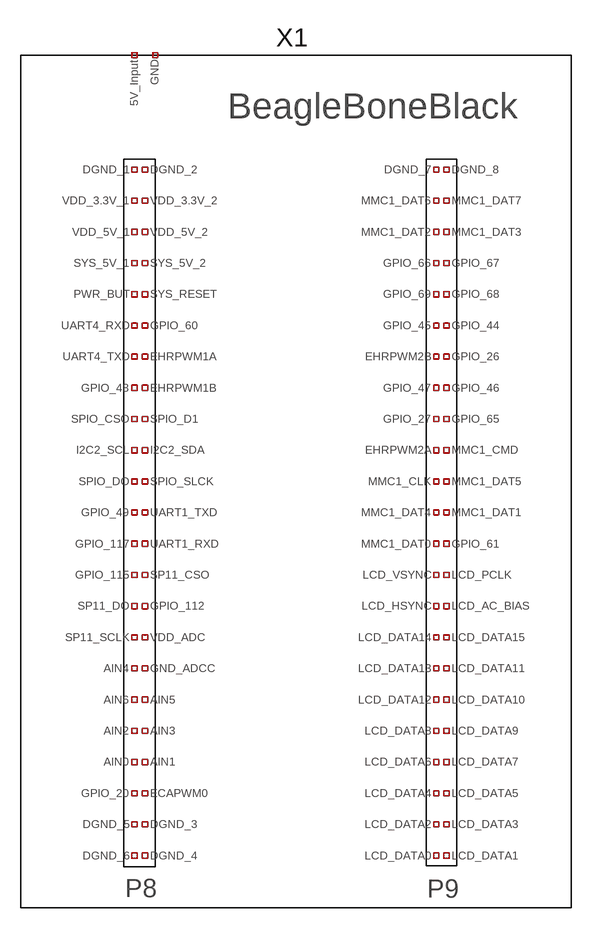
[diagram p0: schematic Beaglebone_Testbench.asc]
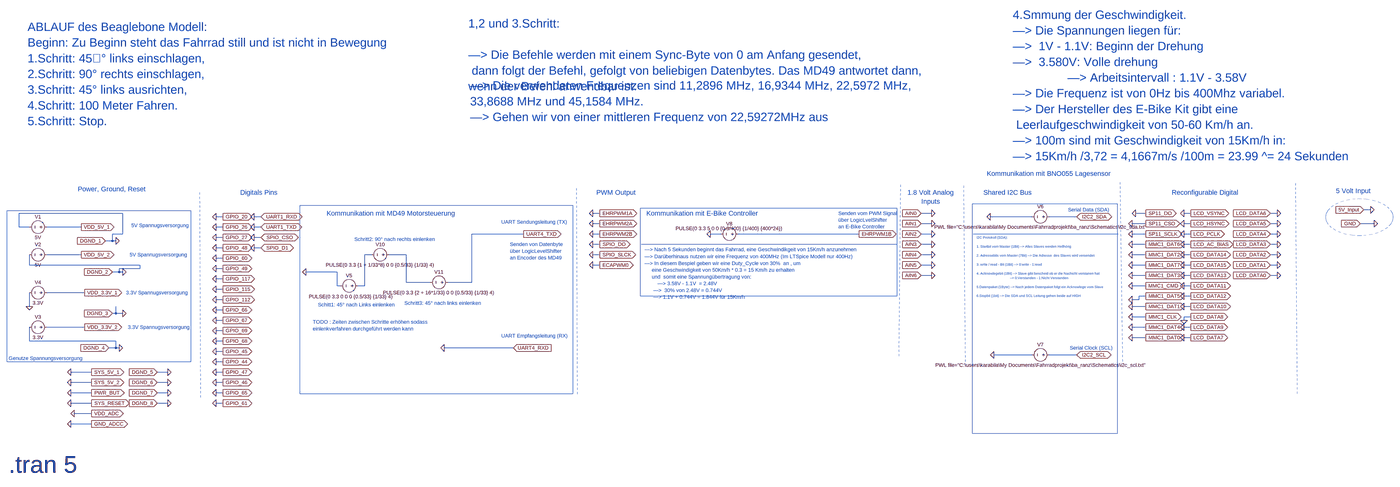
[diagram p1: sub-circuit beaglebone.asc, whole sheet]
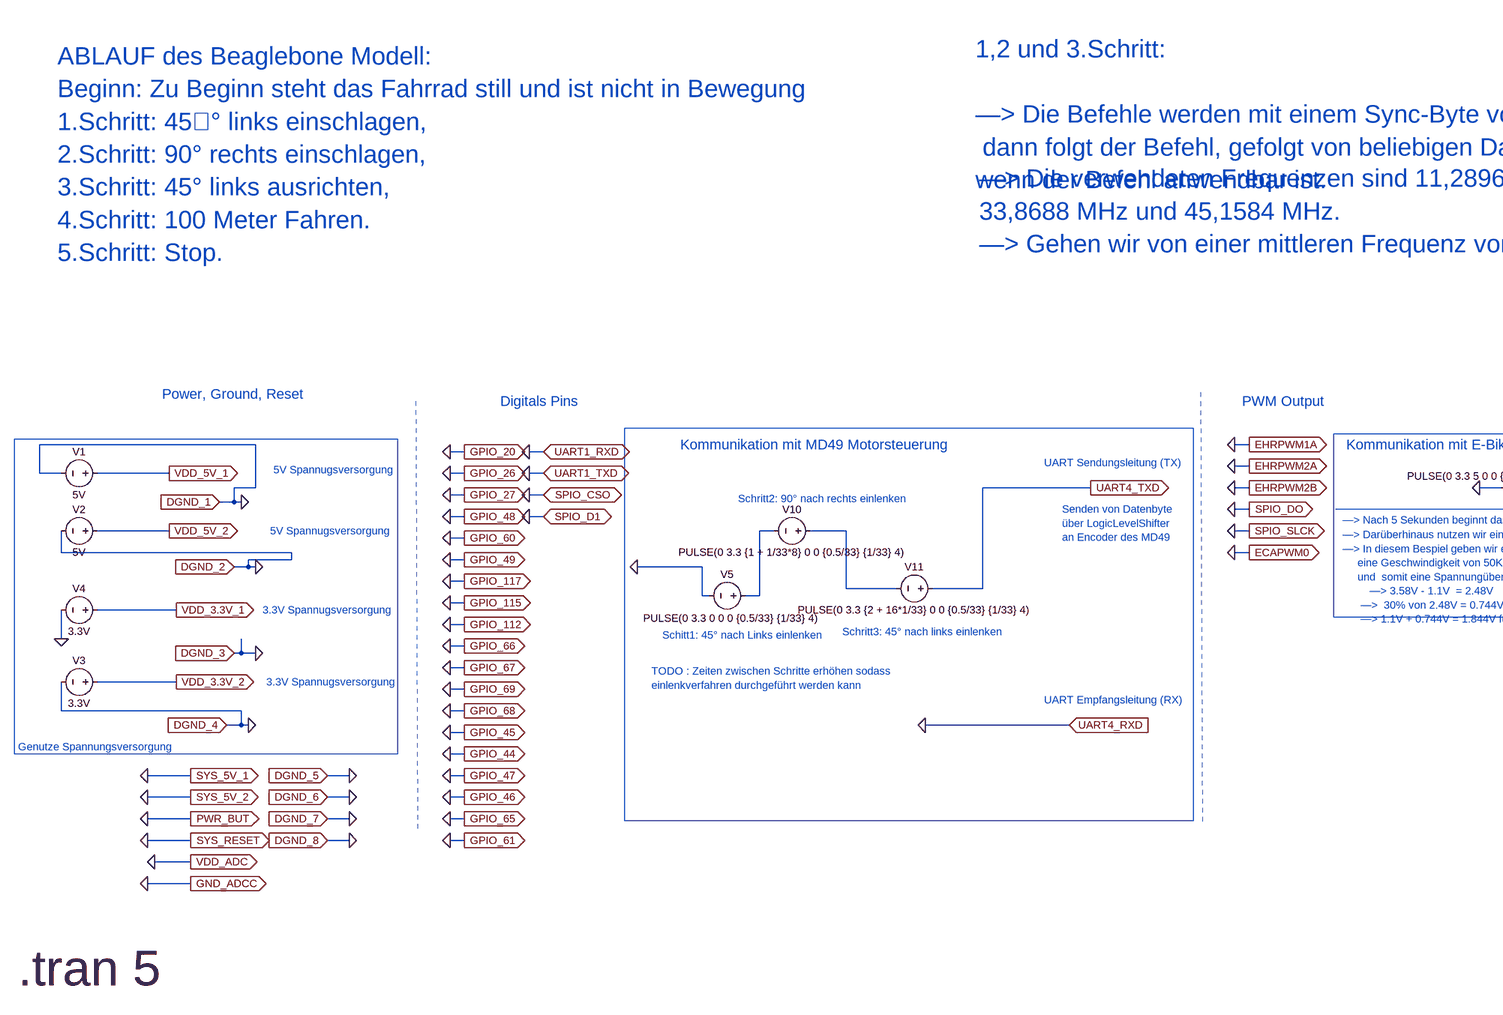
[diagram p2: sub-circuit beaglebone.asc, part, row 1 of 1, column 1 of 2]
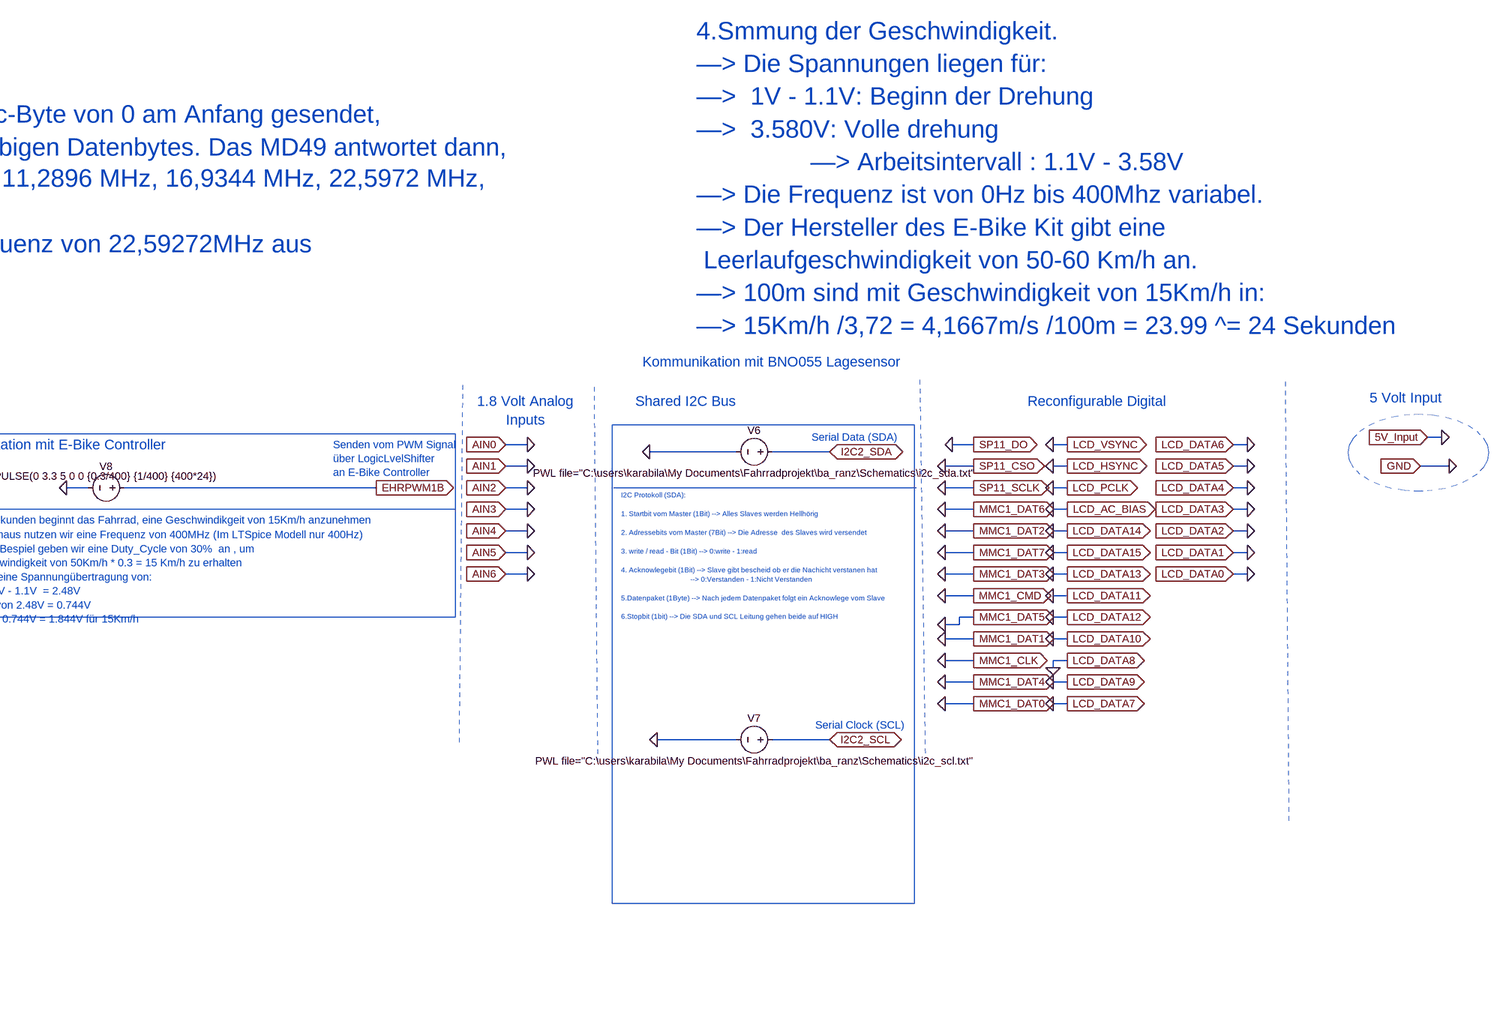
[diagram p3: sub-circuit beaglebone.asc, part, row 1 of 1, column 2 of 2]
Beaglebone_Testbench.asc, the LTspice schematic file:
Version 4
SHEET 1 880 852
SYMBOL Beaglebone 480 64 R0
SYMATTR InstName X1

beaglebone.asc, the sub-circuit schematic file:
Version 4
SHEET 1 9300 680
WIRE 7024 -2544 6992 -2544
WIRE 1248 -2528 768 -2528
WIRE 3456 -2528 3424 -2528
WIRE 4992 -2528 4944 -2528
WIRE 5984 -2528 5936 -2528
WIRE 6192 -2528 6160 -2528
WIRE 6592 -2528 6560 -2528
WIRE 1712 -2512 1680 -2512
WIRE 1888 -2512 1856 -2512
WIRE 5456 -2512 5264 -2512
WIRE 5664 -2512 5536 -2512
WIRE 3456 -2480 3424 -2480
WIRE 4992 -2480 4944 -2480
WIRE 5984 -2480 5920 -2480
WIRE 6192 -2480 6160 -2480
WIRE 6592 -2480 6560 -2480
WIRE 7040 -2480 6976 -2480
WIRE 768 -2464 768 -2528
WIRE 816 -2464 768 -2464
WIRE 1056 -2464 896 -2464
WIRE 1712 -2464 1680 -2464
WIRE 1888 -2464 1856 -2464
WIRE 1248 -2432 1248 -2528
WIRE 1248 -2432 1200 -2432
WIRE 3104 -2432 2864 -2432
WIRE 3456 -2432 3424 -2432
WIRE 4016 -2432 3968 -2432
WIRE 4656 -2432 4096 -2432
WIRE 4992 -2432 4944 -2432
WIRE 5984 -2432 5920 -2432
WIRE 6192 -2432 6160 -2432
WIRE 6592 -2432 6560 -2432
WIRE 1712 -2416 1680 -2416
WIRE 1888 -2416 1856 -2416
WIRE 1200 -2400 1200 -2432
WIRE 1200 -2400 1168 -2400
WIRE 1216 -2400 1200 -2400
WIRE 3456 -2384 3424 -2384
WIRE 4992 -2384 4944 -2384
WIRE 5984 -2384 5920 -2384
WIRE 6192 -2384 6160 -2384
WIRE 6592 -2384 6560 -2384
WIRE 1712 -2368 1680 -2368
WIRE 1888 -2368 1856 -2368
WIRE 1056 -2336 896 -2336
WIRE 2400 -2336 2368 -2336
WIRE 2560 -2336 2480 -2336
WIRE 3456 -2336 3424 -2336
WIRE 4992 -2336 4944 -2336
WIRE 5984 -2336 5920 -2336
WIRE 6192 -2336 6160 -2336
WIRE 6592 -2336 6560 -2336
WIRE 1712 -2320 1680 -2320
WIRE 816 -2288 816 -2336
WIRE 1328 -2288 816 -2288
WIRE 3456 -2288 3424 -2288
WIRE 4992 -2288 4944 -2288
WIRE 5984 -2288 5920 -2288
WIRE 6192 -2288 6160 -2288
WIRE 6592 -2288 6560 -2288
WIRE 1328 -2272 1328 -2288
WIRE 1328 -2272 1232 -2272
WIRE 1712 -2272 1680 -2272
WIRE 1232 -2256 1232 -2272
WIRE 1232 -2256 1200 -2256
WIRE 1248 -2256 1232 -2256
WIRE 2240 -2256 2096 -2256
WIRE 4992 -2240 4944 -2240
WIRE 5984 -2240 5920 -2240
WIRE 6192 -2240 6160 -2240
WIRE 6592 -2240 6560 -2240
WIRE 1712 -2224 1680 -2224
WIRE 2560 -2208 2560 -2336
WIRE 2672 -2208 2560 -2208
WIRE 2864 -2208 2864 -2432
WIRE 2864 -2208 2752 -2208
WIRE 2240 -2192 2240 -2256
WIRE 2256 -2192 2240 -2192
WIRE 2368 -2192 2368 -2336
WIRE 2368 -2192 2336 -2192
WIRE 5984 -2192 5920 -2192
WIRE 6192 -2192 6160 -2192
WIRE 1712 -2176 1680 -2176
WIRE 1072 -2160 896 -2160
WIRE 5984 -2144 5952 -2144
WIRE 6192 -2144 6160 -2144
WIRE 1712 -2128 1680 -2128
WIRE 5952 -2128 5952 -2144
WIRE 5952 -2128 5920 -2128
WIRE 816 -2096 816 -2160
WIRE 5984 -2096 5920 -2096
WIRE 6192 -2096 6160 -2096
WIRE 1712 -2080 1680 -2080
WIRE 1216 -2064 1216 -2096
WIRE 1216 -2064 1200 -2064
WIRE 1248 -2064 1216 -2064
WIRE 5984 -2048 5920 -2048
WIRE 6192 -2048 6160 -2048
WIRE 1712 -2032 1680 -2032
WIRE 6160 -2032 6160 -2048
WIRE 1072 -2000 896 -2000
WIRE 5984 -2000 5920 -2000
WIRE 6192 -2000 6160 -2000
WIRE 1712 -1984 1680 -1984
WIRE 5984 -1952 5920 -1952
WIRE 6192 -1952 6160 -1952
WIRE 816 -1936 816 -2000
WIRE 1216 -1936 816 -1936
WIRE 1712 -1936 1680 -1936
WIRE 1216 -1904 1216 -1936
WIRE 1216 -1904 1184 -1904
WIRE 1232 -1904 1216 -1904
WIRE 3056 -1904 2736 -1904
WIRE 1712 -1888 1680 -1888
WIRE 5456 -1872 5280 -1872
WIRE 5664 -1872 5536 -1872
WIRE 1712 -1840 1680 -1840
WIRE 1104 -1792 1008 -1792
WIRE 1456 -1792 1408 -1792
WIRE 1712 -1792 1680 -1792
WIRE 1104 -1744 1008 -1744
WIRE 1456 -1744 1408 -1744
WIRE 1712 -1744 1680 -1744
WIRE 1104 -1696 1008 -1696
WIRE 1456 -1696 1408 -1696
WIRE 1712 -1696 1680 -1696
WIRE 1104 -1648 1008 -1648
WIRE 1456 -1648 1408 -1648
WIRE 1712 -1648 1680 -1648
WIRE 1104 -1600 1024 -1600
WIRE 1104 -1552 1008 -1552
FLAG 1072 -2000 VDD_3.3V_2
IOPIN 1072 -2000 Out
FLAG 1072 -2160 VDD_3.3V_1
IOPIN 1072 -2160 Out
FLAG 1056 -2336 VDD_5V_2
IOPIN 1056 -2336 Out
FLAG 1056 -2464 VDD_5V_1
IOPIN 1056 -2464 Out
FLAG 1104 -1792 SYS_5V_1
IOPIN 1104 -1792 Out
FLAG 1104 -1744 SYS_5V_2
IOPIN 1104 -1744 Out
FLAG 1104 -1696 PWR_BUT
IOPIN 1104 -1696 Out
FLAG 1104 -1648 SYS_RESET
IOPIN 1104 -1648 Out
FLAG 1104 -1600 VDD_ADC
IOPIN 1104 -1600 Out
FLAG 1104 -1552 GND_ADCC
IOPIN 1104 -1552 Out
FLAG 1712 -2512 GPIO_20
IOPIN 1712 -2512 Out
FLAG 1712 -2464 GPIO_26
IOPIN 1712 -2464 Out
FLAG 1712 -2416 GPIO_27
IOPIN 1712 -2416 Out
FLAG 1712 -2368 GPIO_48
IOPIN 1712 -2368 Out
FLAG 1712 -2320 GPIO_60
IOPIN 1712 -2320 Out
FLAG 1712 -2272 GPIO_49
IOPIN 1712 -2272 Out
FLAG 1712 -2224 GPIO_117
IOPIN 1712 -2224 Out
FLAG 1712 -2176 GPIO_115
IOPIN 1712 -2176 Out
FLAG 1712 -2128 GPIO_112
IOPIN 1712 -2128 Out
FLAG 1712 -2080 GPIO_66
IOPIN 1712 -2080 Out
FLAG 1712 -2032 GPIO_67
IOPIN 1712 -2032 Out
FLAG 1712 -1984 GPIO_69
IOPIN 1712 -1984 Out
FLAG 1712 -1936 GPIO_68
IOPIN 1712 -1936 Out
FLAG 1712 -1888 GPIO_45
IOPIN 1712 -1888 Out
FLAG 1712 -1840 GPIO_44
IOPIN 1712 -1840 Out
FLAG 1712 -1792 GPIO_47
IOPIN 1712 -1792 Out
FLAG 1712 -1744 GPIO_46
IOPIN 1712 -1744 Out
FLAG 1712 -1696 GPIO_65
IOPIN 1712 -1696 Out
FLAG 1712 -1648 GPIO_61
IOPIN 1712 -1648 Out
FLAG 3056 -1904 UART4_RXD
IOPIN 3056 -1904 In
FLAG 3104 -2432 UART4_TXD
IOPIN 3104 -2432 Out
FLAG 1888 -2512 UART1_RXD
IOPIN 1888 -2512 BiDir
FLAG 1888 -2464 UART1_TXD
IOPIN 1888 -2464 BiDir
FLAG 1888 -2416 SPIO_CSO
IOPIN 1888 -2416 BiDir
FLAG 1888 -2368 SPIO_D1
IOPIN 1888 -2368 BiDir
FLAG 3456 -2528 EHRPWM1A
IOPIN 3456 -2528 Out
FLAG 4656 -2432 EHRPWM1B
IOPIN 4656 -2432 Out
FLAG 3456 -2480 EHRPWM2A
IOPIN 3456 -2480 Out
FLAG 3456 -2432 EHRPWM2B
IOPIN 3456 -2432 Out
FLAG 3456 -2384 SPIO_DO
IOPIN 3456 -2384 Out
FLAG 3456 -2336 SPIO_SLCK
IOPIN 3456 -2336 Out
FLAG 3456 -2288 ECAPWM0
IOPIN 3456 -2288 Out
FLAG 4944 -2528 AIN0
IOPIN 4944 -2528 In
FLAG 4944 -2480 AIN1
IOPIN 4944 -2480 In
FLAG 4944 -2432 AIN2
IOPIN 4944 -2432 In
FLAG 4944 -2384 AIN3
IOPIN 4944 -2384 In
FLAG 4944 -2336 AIN4
IOPIN 4944 -2336 In
FLAG 4944 -2288 AIN5
IOPIN 4944 -2288 In
FLAG 4944 -2240 AIN6
IOPIN 4944 -2240 In
FLAG 5664 -1872 I2C2_SCL
IOPIN 5664 -1872 BiDir
FLAG 5664 -2512 I2C2_SDA
IOPIN 5664 -2512 BiDir
FLAG 5984 -2528 SP11_DO
IOPIN 5984 -2528 Out
FLAG 5984 -2480 SP11_CSO
IOPIN 5984 -2480 Out
FLAG 5984 -2432 SP11_SCLK
IOPIN 5984 -2432 Out
FLAG 5984 -2384 MMC1_DAT6
IOPIN 5984 -2384 Out
FLAG 5984 -2336 MMC1_DAT2
IOPIN 5984 -2336 Out
FLAG 5984 -2288 MMC1_DAT7
IOPIN 5984 -2288 Out
FLAG 5984 -2240 MMC1_DAT3
IOPIN 5984 -2240 Out
FLAG 5984 -2192 MMC1_CMD
IOPIN 5984 -2192 Out
FLAG 5984 -2144 MMC1_DAT5
IOPIN 5984 -2144 Out
FLAG 5984 -2096 MMC1_DAT1
IOPIN 5984 -2096 Out
FLAG 5984 -2048 MMC1_CLK
IOPIN 5984 -2048 Out
FLAG 5984 -2000 MMC1_DAT4
IOPIN 5984 -2000 Out
FLAG 5984 -1952 MMC1_DAT0
IOPIN 5984 -1952 Out
FLAG 6192 -2528 LCD_VSYNC
IOPIN 6192 -2528 Out
FLAG 6192 -2480 LCD_HSYNC
IOPIN 6192 -2480 Out
FLAG 6192 -2432 LCD_PCLK
IOPIN 6192 -2432 Out
FLAG 6192 -2384 LCD_AC_BIAS
IOPIN 6192 -2384 Out
FLAG 6192 -2336 LCD_DATA14
IOPIN 6192 -2336 Out
FLAG 6192 -2288 LCD_DATA15
IOPIN 6192 -2288 Out
FLAG 6192 -2240 LCD_DATA13
IOPIN 6192 -2240 Out
FLAG 6192 -2192 LCD_DATA11
IOPIN 6192 -2192 Out
FLAG 6192 -2144 LCD_DATA12
IOPIN 6192 -2144 Out
FLAG 6192 -2096 LCD_DATA10
IOPIN 6192 -2096 Out
FLAG 6192 -2048 LCD_DATA8
IOPIN 6192 -2048 Out
FLAG 6192 -2000 LCD_DATA9
IOPIN 6192 -2000 Out
FLAG 6192 -1952 LCD_DATA7
IOPIN 6192 -1952 Out
FLAG 6560 -2528 LCD_DATA6
IOPIN 6560 -2528 In
FLAG 6560 -2480 LCD_DATA5
IOPIN 6560 -2480 In
FLAG 6560 -2432 LCD_DATA4
IOPIN 6560 -2432 In
FLAG 6560 -2384 LCD_DATA3
IOPIN 6560 -2384 In
FLAG 6560 -2336 LCD_DATA2
IOPIN 6560 -2336 In
FLAG 6560 -2288 LCD_DATA1
IOPIN 6560 -2288 In
FLAG 6560 -2240 LCD_DATA0
IOPIN 6560 -2240 In
FLAG 6992 -2544 5V_Input
IOPIN 6992 -2544 In
FLAG 1008 -1792 0
FLAG 1008 -1744 0
FLAG 1008 -1696 0
FLAG 1008 -1648 0
FLAG 1024 -1600 0
FLAG 1008 -1552 0
FLAG 1680 -2512 0
FLAG 1680 -2464 0
FLAG 1680 -2416 0
FLAG 1680 -2368 0
FLAG 1680 -2320 0
FLAG 1680 -2272 0
FLAG 1680 -2224 0
FLAG 1680 -2176 0
FLAG 1680 -2128 0
FLAG 1680 -2080 0
FLAG 1680 -2032 0
FLAG 1680 -1984 0
FLAG 1680 -1936 0
FLAG 1680 -1888 0
FLAG 1680 -1840 0
FLAG 1680 -1792 0
FLAG 1680 -1744 0
FLAG 1680 -1696 0
FLAG 1680 -1648 0
FLAG 1856 -2368 0
FLAG 1856 -2416 0
FLAG 1856 -2464 0
FLAG 1856 -2512 0
FLAG 2736 -1904 0
FLAG 3968 -2432 0
FLAG 3424 -2480 0
FLAG 3424 -2432 0
FLAG 3424 -2384 0
FLAG 3424 -2336 0
FLAG 3424 -2288 0
FLAG 4992 -2528 0
FLAG 4992 -2480 0
FLAG 4992 -2432 0
FLAG 4992 -2384 0
FLAG 4992 -2336 0
FLAG 4992 -2288 0
FLAG 4992 -2240 0
FLAG 5280 -1872 0
FLAG 5264 -2512 0
FLAG 5920 -2480 0
FLAG 5920 -2432 0
FLAG 5920 -2384 0
FLAG 5920 -2336 0
FLAG 5920 -2288 0
FLAG 5920 -2240 0
FLAG 5920 -2192 0
FLAG 5920 -2128 0
FLAG 5920 -2096 0
FLAG 5920 -2048 0
FLAG 5920 -2000 0
FLAG 5920 -1952 0
FLAG 6160 -2336 0
FLAG 6160 -2528 0
FLAG 6160 -2480 0
FLAG 6160 -2432 0
FLAG 6160 -2384 0
FLAG 6160 -2288 0
FLAG 6160 -2240 0
FLAG 6160 -2192 0
FLAG 6160 -2144 0
FLAG 6160 -2096 0
FLAG 6160 -2032 0
FLAG 6160 -2000 0
FLAG 6160 -1952 0
FLAG 6592 -2240 0
FLAG 6592 -2288 0
FLAG 6592 -2336 0
FLAG 6592 -2384 0
FLAG 6592 -2432 0
FLAG 6592 -2480 0
FLAG 6592 -2528 0
FLAG 7024 -2544 0
FLAG 5936 -2528 0
FLAG 1168 -2400 DGND_1
IOPIN 1168 -2400 In
FLAG 1200 -2256 DGND_2
IOPIN 1200 -2256 In
FLAG 1200 -2064 DGND_3
IOPIN 1200 -2064 In
FLAG 1184 -1904 DGND_4
IOPIN 1184 -1904 In
FLAG 1408 -1792 DGND_5
IOPIN 1408 -1792 In
FLAG 1408 -1744 DGND_6
IOPIN 1408 -1744 In
FLAG 1408 -1696 DGND_7
IOPIN 1408 -1696 In
FLAG 1408 -1648 DGND_8
IOPIN 1408 -1648 In
FLAG 1216 -2400 0
FLAG 1248 -2256 0
FLAG 1248 -2064 0
FLAG 1232 -1904 0
FLAG 1456 -1792 0
FLAG 1456 -1744 0
FLAG 1456 -1696 0
FLAG 6976 -2480 GND
IOPIN 6976 -2480 In
FLAG 7040 -2480 0
FLAG 3424 -2528 0
FLAG 1456 -1648 0
FLAG 2096 -2256 0
FLAG 816 -2096 0
SYMBOL voltage 912 -2464 R90
WINDOW 0 -32 56 VBottom 2
WINDOW 3 32 56 VTop 2
SYMATTR InstName V1
SYMATTR Value 5V
SYMBOL voltage 912 -2336 R90
WINDOW 0 -32 56 VBottom 2
WINDOW 3 32 56 VTop 2
SYMATTR InstName V2
SYMATTR Value 5V
SYMBOL voltage 912 -2000 R90
WINDOW 0 -32 56 VBottom 2
WINDOW 3 32 56 VTop 2
SYMATTR InstName V3
SYMATTR Value 3.3V
SYMBOL voltage 912 -2160 R90
WINDOW 0 -32 56 VBottom 2
WINDOW 3 32 56 VTop 2
SYMATTR InstName V4
SYMATTR Value 3.3V
SYMBOL voltage 2352 -2192 R90
WINDOW 0 -32 56 VBottom 2
WINDOW 3 66 47 VBottom 2
SYMATTR InstName V5
SYMATTR Value PULSE(0 3.3 0 0 0 {0.5/33} {1/33} 4)
SYMBOL voltage 4112 -2432 R90
WINDOW 0 -32 56 VBottom 2
WINDOW 3 -10 56 VBottom 2
SYMATTR InstName V8
SYMATTR Value PULSE(0 3.3 5 0 0 {0.3/400} {1/400} {400*24})
SYMBOL voltage 2496 -2336 R90
WINDOW 0 -32 56 VBottom 2
WINDOW 3 32 56 VTop 2
SYMATTR InstName V10
SYMATTR Value PULSE(0 3.3 {1 + 1/33*8} 0 0 {0.5/33} {1/33} 4)
SYMBOL voltage 2768 -2208 R90
WINDOW 0 -32 56 VBottom 2
WINDOW 3 32 56 VTop 2
SYMATTR InstName V11
SYMATTR Value PULSE(0 3.3 {2 + 16*1/33} 0 0 {0.5/33} {1/33} 4)
SYMBOL voltage 5552 -2512 R90
WINDOW 0 -32 56 VBottom 2
WINDOW 3 32 56 VTop 2
WINDOW 123 0 0 Left 0
WINDOW 39 0 0 Left 0
SYMATTR InstName V6
SYMATTR Value PWL file="C:\users\karabila\My Documents\Fahrradprojekt\ba_ranz\Schematics\i2c_sda.txt"
SYMBOL voltage 5552 -1872 R90
WINDOW 0 -32 56 VBottom 2
WINDOW 3 32 56 VTop 2
WINDOW 123 0 0 Left 0
WINDOW 39 0 0 Left 0
SYMATTR InstName V7
SYMATTR Value PWL file="C:\users\karabila\My Documents\Fahrradprojekt\ba_ranz\Schematics\i2c_scl.txt"
TEXT 1040 -2640 Left 3 ;Power, Ground, Reset
TEXT 1792 -2624 Left 3 ;Digitals Pins
TEXT 3440 -2624 Left 3 ;PWM Output
TEXT 4880 -2624 Left 3 ;1.8 Volt Analog \n       Inputs
TEXT 5232 -2624 Left 3 ;Shared I2C Bus
TEXT 6104 -2624 Left 3 ;Reconfigurable Digital
TEXT 6864 -2632 Left 3 ;5 Volt Input
TEXT 720 -1256 Left 7 !.tran 5
TEXT 1288 -2472 Left 2 ;5V Spannugsversorgung
TEXT 1280 -2336 Left 2 ;5V Spannugsversorgung
TEXT 1264 -2160 Left 2 ;3.3V Spannugsversorgung
TEXT 1272 -2000 Left 2 ;3.3V Spannugsversorgung
TEXT 2192 -2528 Left 3 ;Kommunikation mit MD49 Motorsteuerung
TEXT 3000 -1960 Left 2 ;UART Empfangsleitung (RX)
TEXT 3000 -2488 Left 2 ;UART Sendungsleitung (TX)
TEXT 720 -1856 Left 2 ;Genutze Spannungsversorgung
TEXT 5248 -2712 Left 3 ;Kommunikation mit BNO055 Lagesensor
TEXT 3672 -2528 Left 3 ;Kommunikation mit E-Bike Controller
TEXT 5632 -1904 Left 2 ;Serial Clock (SCL)
TEXT 5624 -2544 Left 2 ;Serial Data (SDA)
TEXT 3664 -2360 Left 2 ;—> Nach 5 Sekunden beginnt das Fahrrad, eine Geschwindikgeit von 15Km/h anzunehmen
TEXT 3040 -2384 Left 2 ;Senden von Datenbyte \nüber LogicLevelShifter \nan Encoder des MD49
TEXT 808 -3392 Left 5 ;ABLAUF des Beaglebone Modell:\nBeginn: Zu Beginn steht das Fahrrad still und ist nicht in Bewegung \n1.Schritt: 45° links einschlagen,\n2.Schritt: 90° rechts einschlagen,\n3.Schritt: 45° links ausrichten,\n4.Schritt: 100 Meter Fahren.\n5.Schritt: Stop.
TEXT 2848 -3408 Left 5 ;1,2 und 3.Schritt:\n\n—> Die Befehle werden mit einem Sync-Byte von 0 am Anfang gesendet,\n dann folgt der Befehl, gefolgt von beliebigen Datenbytes. Das MD49 antwortet dann,\nwenn der Befehl anwendbar ist.
TEXT 5368 -3448 Left 5 ;4.Smmung der Geschwindigkeit.\n—> Die Spannungen liegen für: \n—>  1V - 1.1V: Beginn der Drehung  \n—>  3.580V: Volle drehung\n                —> Arbeitsintervall : 1.1V - 3.58V\n—> Die Frequenz ist von 0Hz bis 400Mhz variabel.\n—> Der Hersteller des E-Bike Kit gibt eine\n Leerlaufgeschwindigkeit von 50-60 Km/h an.\n—> 100m sind mit Geschwindigkeit von 15Km/h in:\n—> 15Km/h /3,72 = 4,1667m/s /100m = 23.99 ^= 24 Sekunden
TEXT 2152 -2104 Left 2 ;Schitt1: 45° nach Links einlenken
TEXT 2320 -2408 Left 2 ;Schritt2: 90° nach rechts einlenken
TEXT 2552 -2112 Left 2 ;Schritt3: 45° nach links einlenken
TEXT 3664 -2296 Left 2 ;—> In diesem Bespiel geben wir eine Duty_Cycle von 30%  an , um        \n     eine Geschwindigkeit von 50Km/h * 0.3 = 15 Km/h zu erhalten     \n     und  somit eine Spannungübertragung von:\n     	—> 3.58V - 1.1V  = 2.48V\n      —>  30% von 2.48V = 0.744V\n      —> 1.1V + 0.744V = 1.844V für 15Km/h
TEXT 3664 -2328 Left 2 ;—> Darüberhinaus nutzen wir eine Frequenz von 400MHz (Im LTSpice Modell nur 400Hz)
TEXT 2856 -3120 Left 5 ;—> Die verwendeten Frequenzen sind 11,2896 MHz, 16,9344 MHz, 22,5972 MHz, \n33,8688 MHz und 45,1584 MHz.\n—> Gehen wir von einer mittleren Frequenz von 22,59272MHz aus
TEXT 2128 -2024 Left 2 ;TODO : Zeiten zwischen Schritte erhöhen sodass \neinlenkverfahren durchgeführt werden kann
TEXT 4560 -2528 Left 2 ;Senden vom PWM Signal \nüber LogicLvelShifter \nan E-Bike Controller
TEXT 5200 -2416 Left 1 ;I2C Protokoll (SDA):\n \n1. Startbit vom Master (1Bit) --> Alles Slaves werden Hellhörig\n \n2. Adressebits vom Master (7Bit) --> Die Adresse  des Slaves wird versendet\n \n3. write / read - Bit (1Bit) --> 0:write - 1:read\n \n4. Acknowlegebit (1Bit) --> Slave gibt bescheid ob er die Nachicht verstanen hat\n                                     --> 0:Verstanden - 1:Nicht Verstanden      \n \n5.Datenpaket (1Byte) --> Nach jedem Datenpaket folgt ein Acknowlege vom Slave \n \n6.Stopbit (1bit) --> Die SDA und SCL Leitung gehen beide auf HIGH
LINE Normal 1604 -2624 1608 -1664 4
LINE Normal 3348 -2644 3352 -1680 4
LINE Normal 4848 -2660 4840 -1856 4
LINE Normal 5140 -2656 5148 -1820 4
LINE Normal 5864 -2672 5876 -1832 4
LINE Normal 6676 -2668 6684 -1692 4
LINE Normal 4832 -2384 3648 -2384
LINE Normal 5856 -2432 5184 -2432
RECTANGLE Normal 2068 -2564 3332 -1692
RECTANGLE Normal 712 -2540 1564 -1840
RECTANGLE Normal 3644 -2552 4832 -2144
RECTANGLE Normal 5180 -2572 5852 -1508
CIRCLE Normal 6816 -2596 7128 -2424 2

The netlist it stands for:
* Beaglebone_Testbench.asc
XX1 NC_01 NC_02 NC_03 NC_04 NC_05 NC_06 NC_07 NC_08 NC_09 NC_10 NC_11 NC_12 NC_13 NC_14 NC_15 NC_16 NC_17 NC_18 NC_19 NC_20 NC_21 NC_22 NC_23 NC_24 NC_25 NC_26 NC_27 NC_28 NC_29 NC_30 NC_31 NC_32 NC_33 NC_34 NC_35 NC_36 NC_37 NC_38 NC_39 NC_40 NC_41 NC_42 NC_43 NC_44 NC_45 NC_46 NC_47 NC_48 NC_49 NC_50 NC_51 NC_52 NC_53 NC_54 NC_55 NC_56 NC_57 NC_58 NC_59 NC_60 NC_61 NC_62 NC_63 NC_64 NC_65 NC_66 NC_67 NC_68 NC_69 NC_70 NC_71 NC_72 NC_73 NC_74 NC_75 NC_76 NC_77 NC_78 NC_79 NC_80 NC_81 NC_82 NC_83 NC_84 NC_85 NC_86 NC_87 NC_88 NC_89 NC_90 NC_91 NC_92 NC_93 NC_94 beaglebone

* block symbol definitions
.subckt beaglebone AIN0 AIN1 AIN2 AIN3 AIN4 AIN5 AIN6 5V_Input LCD_DATA0 LCD_DATA1 LCD_DATA2 LCD_DATA3 LCD_DATA4 LCD_DATA5 LCD_DATA6 DGND_1 DGND_2 DGND_3 DGND_4 DGND_5 DGND_6 DGND_7 DGND_8 ECAPWM0 EHRPWM1A EHRPWM1B EHRPWM2A EHRPWM2B GND_ADCC GPIO_112 GPIO_115 GPIO_117 GPIO_20 GPIO_26 GPIO_27 GPIO_44 GPIO_45 GPIO_46 GPIO_47 GPIO_48 GPIO_49 GPIO_60 GPIO_61 GPIO_65 GPIO_66 GPIO_67 GPIO_68 GPIO_69 I2C2_SCL I2C2_SDA LCD_AC_BIAS LCD_HSYNC LCD_PCLK LCD_VSYNC MMC1_CLK MMC1_CMD MMC1_DAT0 MMC1_DAT1 MMC1_DAT2 MMC1_DAT3 MMC1_DAT4 MMC1_DAT5 MMC1_DAT6 MMC1_DAT7 PWR_BUT SP11_CSO LCD_DATA10 LCD_DATA11 LCD_DATA12 LCD_DATA13 LCD_DATA14 LCD_DATA15 LCD_DATA7 LCD_DATA8 LCD_DATA9 SP11_DO SP11_SCLK SPIO_CSO SPIO_D1 SPIO_DO SPIO_SLCK SYS_5V_1 SYS_5V_2 SYS_RESET UART1_RXD UART4_RXD UART4_TXD VDD_3.3V_1 VDD_3.3V_2 VDD_5V_1 VDD_5V_2 VDD_ADC UART1_TXD GND
V1 VDD_5V_1 0 5V
V2 VDD_5V_2 0 5V
V3 VDD_3.3V_2 0 3.3V
V4 VDD_3.3V_1 0 3.3V
V5 N001 0 PULSE(0 3.3 0 0 0 {0.5/33} {1/33} 4)
V8 EHRPWM1B 0 PULSE(0 3.3 5 0 0 {0.3/400} {1/400} {400*24})
V10 N002 N001 PULSE(0 3.3 {1 + 1/33*8} 0 0 {0.5/33} {1/33} 4)
V11 UART4_TXD N002 PULSE(0 3.3 {2 + 16*1/33} 0 0 {0.5/33} {1/33} 4)
V6 I2C2_SDA 0 PWL file="C:\users\karabila\My Documents\Fahrradprojekt\ba_ranz\Schematics\i2c_sda.txt"
V7 I2C2_SCL 0 PWL file="C:\users\karabila\My Documents\Fahrradprojekt\ba_ranz\Schematics\i2c_scl.txt"
* Power, Ground, Reset
* Digitals Pins
* PWM Output
* 1.8 Volt Analog
*        Inputs
* Shared I2C Bus
* Reconfigurable Digital
* 5 Volt Input
.tran 5
* 5V Spannugsversorgung
* 5V Spannugsversorgung
* 3.3V Spannugsversorgung
* 3.3V Spannugsversorgung
* Kommunikation mit MD49 Motorsteuerung
* UART Empfangsleitung (RX)
* UART Sendungsleitung (TX)
* Genutze Spannungsversorgung
* Kommunikation mit BNO055 Lagesensor
* Kommunikation mit E-Bike Controller
* Serial Clock (SCL)
* Serial Data (SDA)
* —> Nach 5 Sekunden beginnt das Fahrrad, eine Geschwindikgeit von 15Km/h anzunehmen
* Senden von Datenbyte
* über LogicLevelShifter
* an Encoder des MD49
* ABLAUF des Beaglebone Modell:
* Beginn: Zu Beginn steht das Fahrrad still und ist nicht in Bewegung
* 1.Schritt: 45° links einschlagen,
* 2.Schritt: 90° rechts einschlagen,
* 3.Schritt: 45° links ausrichten,
* 4.Schritt: 100 Meter Fahren.
* 5.Schritt: Stop.
* 1,2 und 3.Schritt:
* —> Die Befehle werden mit einem Sync-Byte von 0 am Anfang gesendet,
*  dann folgt der Befehl, gefolgt von beliebigen Datenbytes. Das MD49 antwortet dann,
* wenn der Befehl anwendbar ist.
* 4.Smmung der Geschwindigkeit.
* —> Die Spannungen liegen für:
* —>  1V - 1.1V: Beginn der Drehung
* —>  3.580V: Volle drehung
*                 —> Arbeitsintervall : 1.1V - 3.58V
* —> Die Frequenz ist von 0Hz bis 400Mhz variabel.
* —> Der Hersteller des E-Bike Kit gibt eine
*  Leerlaufgeschwindigkeit von 50-60 Km/h an.
* —> 100m sind mit Geschwindigkeit von 15Km/h in:
* —> 15Km/h /3,72 = 4,1667m/s /100m = 23.99 ^= 24 Sekunden
* Schitt1: 45° nach Links einlenken
* Schritt2: 90° nach rechts einlenken
* Schritt3: 45° nach links einlenken
* —> In diesem Bespiel geben wir eine Duty_Cycle von 30%  an , um
*      eine Geschwindigkeit von 50Km/h * 0.3 = 15 Km/h zu erhalten
*      und  somit eine Spannungübertragung von:
*      	—> 3.58V - 1.1V  = 2.48V
*       —>  30% von 2.48V = 0.744V
*       —> 1.1V + 0.744V = 1.844V für 15Km/h
* —> Darüberhinaus nutzen wir eine Frequenz von 400MHz (Im LTSpice Modell nur 400Hz)
* —> Die verwendeten Frequenzen sind 11,2896 MHz, 16,9344 MHz, 22,5972 MHz,
* 33,8688 MHz und 45,1584 MHz.
* —> Gehen wir von einer mittleren Frequenz von 22,59272MHz aus
* TODO : Zeiten zwischen Schritte erhöhen sodass
* einlenkverfahren durchgeführt werden kann
* Senden vom PWM Signal
* über LogicLvelShifter
* an E-Bike Controller
* I2C Protokoll (SDA):
* 1. Startbit vom Master (1Bit) --> Alles Slaves werden Hellhörig
* 2. Adressebits vom Master (7Bit) --> Die Adresse  des Slaves wird versendet
* 3. write / read - Bit (1Bit) --> 0:write - 1:read
* 4. Acknowlegebit (1Bit) --> Slave gibt bescheid ob er die Nachicht verstanen hat
*                                      --> 0:Verstanden - 1:Nicht Verstanden
* 5.Datenpaket (1Byte) --> Nach jedem Datenpaket folgt ein Acknowlege vom Slave
* 6.Stopbit (1bit) --> Die SDA und SCL Leitung gehen beide auf HIGH
.ends beaglebone

.backanno
.end